# EasyEDA Pro project ProProject_四足舵机控制板V2-PCA9685_2024-05-28.epro, board PCB1
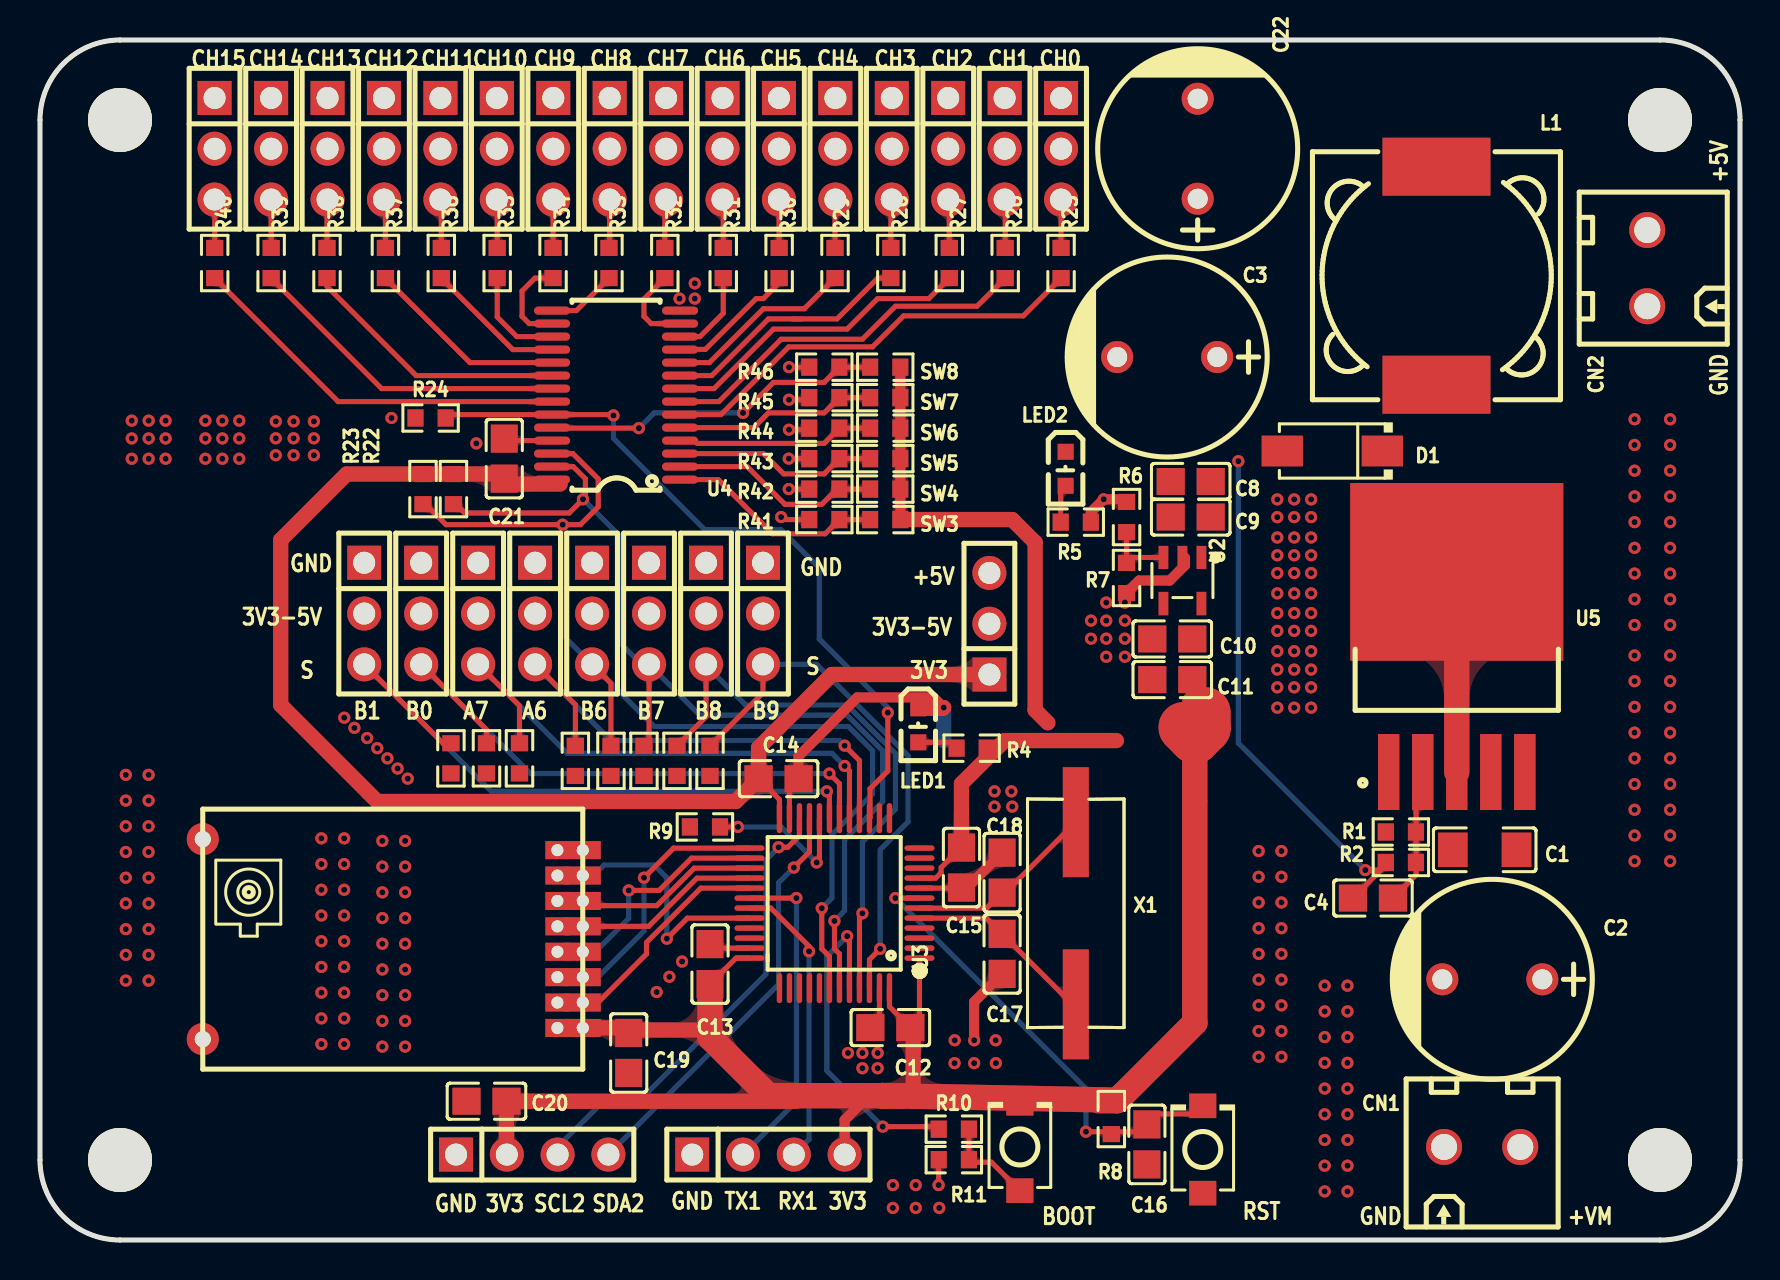
[diagram p5: board, top side]
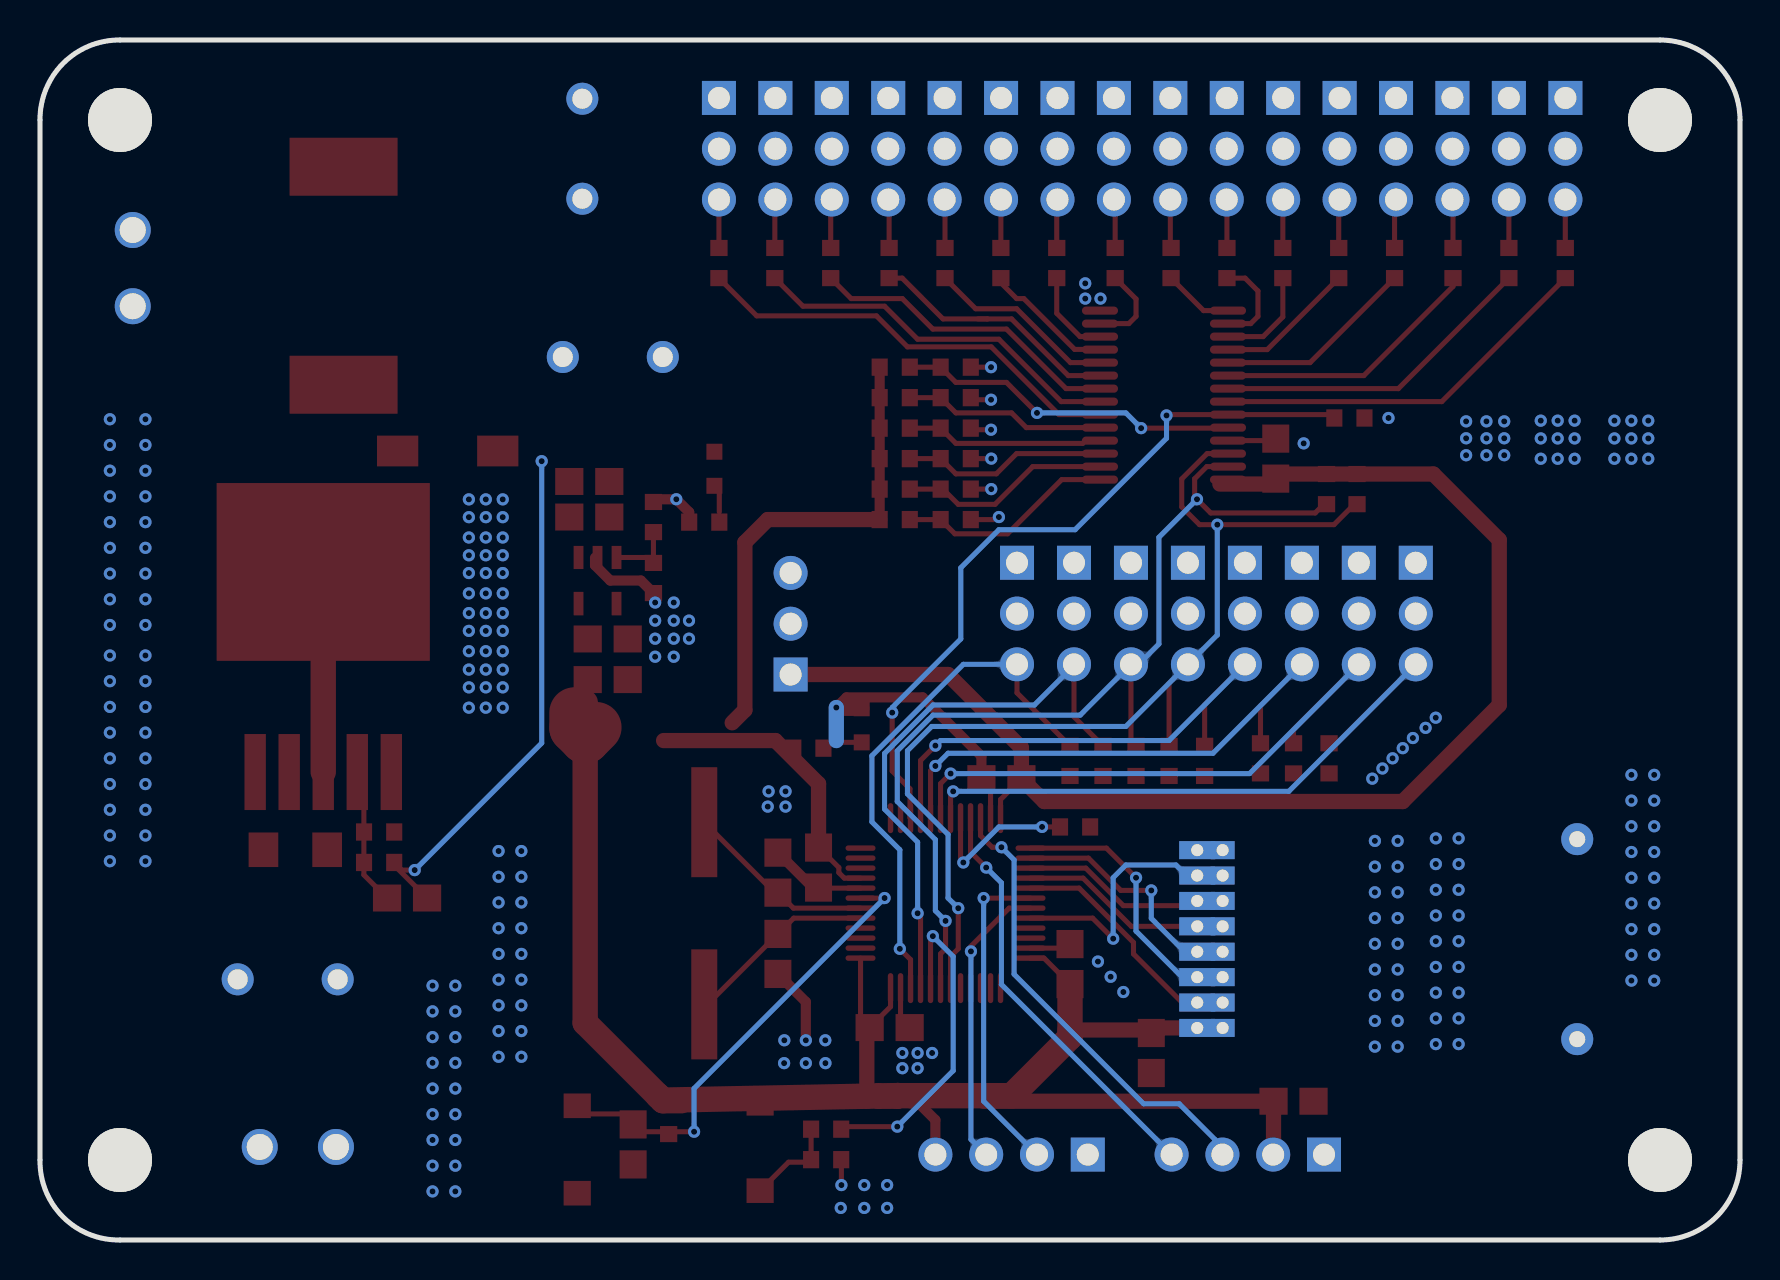
[diagram p6: board, bottom side, seen from below]

Outline 85 x 60 mm; copper layers: Top Layer, Bottom Layer. Coordinates in mm from the lower left corner of the outline.
Outline path: 0,56 0,4 arc(1.17,1.17) 4,0 81,0 arc(83.85,1.15) 85,4 85,56 arc(83.84,58.84) 81,60 4,60 arc(1.17,58.83) 0,56
Stack: Top Layer 0.035mm / Dielectric1 1.51mm FR4 er 4.5 / Bottom Layer 0.035mm

## Design rules (mm)
template: 自定义配置
spacing copperThickness1oz (default): track to track 0.102, other pairs 0.152 to 0.3
spacing copperThickness2oz: track to track 0.203, other pairs 0.152 to 0.3
track width copperThickness1oz (default): min 0.127, default 0.254, max 2.54
track width copperThickness2oz: min 0.203, default 0.254, max 2.54
differential pair differentialPair (default): width min 0.127, default 0.254, max 2.54; gap min 0.152, default 0.152
via viaSize (default): diameter min 0.5, default 0.61, max 10; hole min 0.3, default 0.305, max 6.3

## Placement (name value [footprint] x y rotation side)
C1  1μF  [C1206]  72.24 19.51 0 top
C2  470uF  [CAP-TH_BD10.0-P5.00-D0.6-FD]  72.62 13.03 180 top
C3  470uF  [CAP-TH_BD10.0-P5.00-D0.6-FD]  56.36 44.15 180 top
C4  33nF  [C0805]  66.65 17.1 0 top
C8  100nF  [C0805]  57.54 37.93 0 top
C9  1μF  [C0805]  57.54 36.15 0 top
C10  1μF  [C0805]  56.61 30.05 0 top
C11  100nF  [C0805]  56.61 28.02 0 top
C12  100nF  [C0805]  42.52 10.62 0 top
C13  100nF  [C0805]  33.5 13.8 270 top
C14  100nF  [C0805]  36.93 23.07 180 top
C15  100nF  [C0805]  46.07 18.62 90 top
C16  100nF  [C0805]  55.34 4.78 90 top
C17  22pF  [C0805]  48.1 14.3 270 top
C18  22pF  [C0805]  48.1 18.37 90 top
C19  100nF  [C0805]  29.44 9.35 90 top
C20  100nF  [C0805]  22.32 6.94 0 top
C21  100nF  [C0805]  23.21 39.07 90 top
C22  470uF  [CAP-TH_BD10.0-P5.00-D0.6-FD]  57.88 54.56 90 top
CN1  MX128L-3.81-02P-GN01-Cu-Y-A  [CONN-TH_2P-P3.81_MX128L-3.81-GN01-02P-CU-Y-A]  72.11 4.65 0 top
CN2  MX128L-3.81-02P-GN01-Cu-Y-A  [CONN-TH_2P-P3.81_MX128L-3.81-GN01-02P-CU-Y-A]  80.36 48.59 90 top
D1  SS54  [SMA_L4.4-W2.8-LS5.4-R-RD]  64.62 39.45 180 top
H1  PZ254V-11-03P  [HDR-TH_3P-P2.54-V-M]  24.75 31.32 270 top
H2  PZ254V-11-03P  [HDR-TH_3P-P2.54-V-M]  21.91 31.32 270 top
H3  PZ254V-11-03P  [HDR-TH_3P-P2.54-V-M]  19.06 31.32 270 top
H4  PZ254V-11-03P  [HDR-TH_3P-P2.54-V-M]  16.21 31.32 270 top
H5  PZ254V-11-03P  [HDR-TH_3P-P2.54-V-M]  27.6 31.32 270 top
H6  PZ254V-11-03P  [HDR-TH_3P-P2.54-V-M]  30.45 31.32 270 top
H7  PZ254V-11-03P  [HDR-TH_3P-P2.54-V-M]  33.3 31.32 270 top
H8  PZ254V-11-03P  [HDR-TH_3P-P2.54-V-M]  36.15 31.32 270 top
H11  PZ254V-11-04P  [HDR-TH_4P-P2.54-V-M]  36.42 4.27 0 top
H12  PZ254V-11-04P  [HDR-TH_4P-P2.54-V-M]  24.61 4.27 0 top
H13  PZ254V-11-03P  [HDR-TH_3P-P2.54-V-M]  47.47 30.81 90 top
H14  PZ254V-11-03P  [HDR-TH_3P-P2.54-V-M]  51.05 54.56 270 top
H15  PZ254V-11-03P  [HDR-TH_3P-P2.54-V-M]  48.23 54.56 270 top
H16  PZ254V-11-03P  [HDR-TH_3P-P2.54-V-M]  45.41 54.56 270 top
H17  PZ254V-11-03P  [HDR-TH_3P-P2.54-V-M]  42.59 54.56 270 top
H18  PZ254V-11-03P  [HDR-TH_3P-P2.54-V-M]  39.77 54.56 270 top
H19  PZ254V-11-03P  [HDR-TH_3P-P2.54-V-M]  36.95 54.56 270 top
H20  PZ254V-11-03P  [HDR-TH_3P-P2.54-V-M]  34.13 54.56 270 top
H21  PZ254V-11-03P  [HDR-TH_3P-P2.54-V-M]  31.3 54.56 270 top
H22  PZ254V-11-03P  [HDR-TH_3P-P2.54-V-M]  28.48 54.56 270 top
H23  PZ254V-11-03P  [HDR-TH_3P-P2.54-V-M]  25.66 54.56 270 top
H24  PZ254V-11-03P  [HDR-TH_3P-P2.54-V-M]  22.84 54.56 270 top
H25  PZ254V-11-03P  [HDR-TH_3P-P2.54-V-M]  20.02 54.56 270 top
H26  PZ254V-11-03P  [HDR-TH_3P-P2.54-V-M]  17.2 54.56 270 top
H27  PZ254V-11-03P  [HDR-TH_3P-P2.54-V-M]  14.38 54.56 270 top
H28  PZ254V-11-03P  [HDR-TH_3P-P2.54-V-M]  11.56 54.56 270 top
H29  PZ254V-11-03P  [HDR-TH_3P-P2.54-V-M]  8.73 54.56 270 top
L1  33uH  [IND-SMD_L12.3-W12.3]  69.82 48.21 270 top
LED1  SZYY0603G  [LED0603-R-RD_GREEN]  43.91 25.73 270 top
LED2  SZYY0603G  [LED0603-R-RD_GREEN]  51.28 38.56 270 top
MK1  -  [AS01-SPIPX]  17.24 15.57 180 top
NOREF  -  [Pad_e91]  4 4 0 top
NOREF#2  -  [Pad_e93]  81 4 0 top
NOREF#3  -  [Pad_e86]  4 56 0 top
NOREF#4  -  [Pad_e88]  81 56 0 top
R1  2kΩ  [R0603]  68.04 20.4 180 top
R2  10.5kΩ  [R0603]  68.04 18.88 180 top
R4  2kΩ  [R0603]  46.58 24.59 0 top
R5  2kΩ  [R0603]  51.79 35.89 0 top
R6  10kΩ  [R0603]  54.33 36.15 90 top
R7  100kΩ  [R0603]  54.33 33.1 90 top
R8  10kΩ  [R0603]  53.57 6.05 90 top
R9  10kΩ  [R0603]  33.25 20.65 0 top
R10  2kΩ  [R0603]  45.69 5.54 180 top
R11  10kΩ  [R0603]  45.69 4.02 0 top
R14  1kΩ  [R0603]  26.77 23.96 90 top
R15  1kΩ  [R0603]  23.97 24.08 90 top
R16  1kΩ  [R0603]  22.32 24.08 90 top
R17  1kΩ  [R0603]  20.55 24.08 90 top
R18  1kΩ  [R0603]  28.55 23.96 90 top
R19  1kΩ  [R0603]  30.2 23.96 90 top
R20  1kΩ  [R0603]  31.85 23.96 90 top
R21  1kΩ  [R0603]  33.5 23.96 90 top
R22  10kΩ  [R0603]  20.67 37.55 90 top
R23  10kΩ  [R0603]  19.15 37.55 90 top
R24  10kΩ  [R0603]  19.53 41.1 0 top
R25  10kΩ  [R0603]  51.05 48.85 270 top
R26  10kΩ  [R0603]  48.26 48.85 270 top
R27  10kΩ  [R0603]  45.47 48.85 270 top
R28  10kΩ  [R0603]  42.54 48.85 270 top
R29  10kΩ  [R0603]  39.75 48.85 270 top
R30  10kΩ  [R0603]  36.96 48.85 270 top
R31  10kΩ  [R0603]  34.16 48.85 270 top
R32  10kΩ  [R0603]  31.24 48.85 270 top
R33  10kΩ  [R0603]  28.45 48.85 270 top
R34  10kΩ  [R0603]  25.65 48.85 270 top
R35  10kΩ  [R0603]  22.86 48.85 270 top
R36  10kΩ  [R0603]  20.06 48.85 270 top
R37  10kΩ  [R0603]  17.27 48.85 270 top
R38  10kΩ  [R0603]  14.35 48.85 270 top
R39  10kΩ  [R0603]  11.56 48.85 270 top
R40  10kΩ  [R0603]  8.73 48.85 270 top
R41  10kΩ  [R0603]  39.22 36.02 180 top
R42  10kΩ  [R0603]  39.22 37.55 180 top
R43  10kΩ  [R0603]  39.22 39.07 180 top
R44  10kΩ  [R0603]  39.22 40.59 180 top
R45  10kΩ  [R0603]  39.22 42.12 180 top
R46  10kΩ  [R0603]  39.22 43.64 180 top
SW1  TS-1088-AR02016  [SW-SMD_L3.9-W3.0-P4.45]  58.14 4.53 90 top
SW2  TS-1088-AR02016  [SW-SMD_L3.9-W3.0-P4.45]  48.99 4.65 90 top
SW3  TS342A2P-WZ  [R0603]  42.26 36.02 0 top
SW4  TS342A2P-WZ  [R0603]  42.26 37.55 0 top
SW5  TS342A2P-WZ  [R0603]  42.26 39.07 0 top
SW6  TS342A2P-WZ  [R0603]  42.26 40.59 0 top
SW7  TS342A2P-WZ  [R0603]  42.26 42.12 0 top
SW8  TS342A2P-WZ  [R0603]  42.26 43.64 0 top
U2  RT9013-33GB  [SOT-23-5_L3.0-W1.7-P0.95-LS2.8-BL]  57.12 32.97 180 top
U3  STM32F103C8T6  [LQFP-48_L7.0-W7.0-P0.50-LS9.0-BL]  39.72 16.84 90 top
U4  PCA9685PW,118  [TSSOP-28_L9.7-W4.4-P0.65-LS6.4-TL]  28.8 42.24 180 top
U5  XL4005E1  [TO-263-5_L10.2-W9.2-P1.70-TL]  70.84 28.4 90 top
X1  -  [HC-49S_L11.4-W4.8]  51.79 16.34 270 top

## Footprints (pads in the part's own frame, mm; a bottom-side part is the same pattern mirrored in y, then rotated)
AS01-SPIPX
  round 1.6 hole 0.8: 0(9.105,5.531) 0(9.105,-4.469)
  rect 1.8x0.9 hole 0.6: 1(-9.895,4.971) 2(-9.895,3.701) 3(-9.895,2.431) 4(-9.895,1.161) 5(-9.895,-0.109) 6(-9.895,-1.379) 7(-9.895,-2.649) 8(-9.895,-3.919)
  rect 1.2x0.9 hole 0.6: 1(-8.625,4.971) 2(-8.625,3.701) 3(-8.625,2.431) 4(-8.625,1.161) 5(-8.625,-0.109) 6(-8.625,-1.379) 7(-8.625,-2.649) 8(-8.625,-3.919)
C0805
  rect 1.41x1.35 smd: 1(-1,0) 2(1,0)
C1206
  rect 1.485x1.728 smd: 1(-1.593,0) 2(1.593,0)
CAP-TH_BD10.0-P5.00-D0.6-FD
  round 1.6 hole 1: 1(-2.5,0) 2(2.5,0)
CONN-TH_2P-P3.81_MX128L-3.81-GN01-02P-CU-Y-A
  round 1.8 hole 1.3: 1(-1.905,0) 2(1.905,0)
HC-49S_L11.4-W4.8
  rect 5.5x1.3 smd: 1(-4.553,0) 2(4.553,0)
HDR-TH_3P-P2.54-V-M
  rect 1.7x1.7 hole 1.1: 1(-2.54,0)
  round 1.7 hole 1.1: 2(0,0) 3(2.54,0)
HDR-TH_4P-P2.54-V-M
  rect 1.7x1.7 hole 1.1: 1(-3.81,0)
  round 1.7 hole 1.1: 2(-1.27,0) 3(1.27,0) 4(3.81,0)
IND-SMD_L12.3-W12.3
  rect 2.9x5.4 smd: 1(-5.45,0) 2(5.45,0)
LED0603-R-RD_GREEN
  rect 0.8x0.8 smd: 1(0.851,0) 2(-0.851,0)
LQFP-48_L7.0-W7.0-P0.50-LS9.0-BL
  oval 0.27x1.5 smd: 1(-2.75,-4.25) 2(-2.25,-4.25) 3(-1.75,-4.25) 4(-1.25,-4.25) 5(-0.75,-4.25) 6(-0.25,-4.25) 7(0.25,-4.25) 8(0.75,-4.25) 9(1.25,-4.25) 10(1.75,-4.25) 11(2.25,-4.25) 12(2.75,-4.25) 25(2.75,4.25) 26(2.25,4.25) 27(1.75,4.25) 28(1.25,4.25) 29(0.75,4.25) 30(0.25,4.25) 31(-0.25,4.25) 32(-0.75,4.25) 33(-1.25,4.25) 34(-1.75,4.25) 35(-2.25,4.25) 36(-2.75,4.25)
  oval 1.5x0.27 smd: 13(4.25,-2.75) 14(4.25,-2.25) 15(4.25,-1.75) 16(4.25,-1.25) 17(4.25,-0.75) 18(4.25,-0.25) 19(4.25,0.25) 20(4.25,0.75) 21(4.25,1.25) 22(4.25,1.75) 23(4.25,2.25) 24(4.25,2.75) 37(-4.25,2.75) 38(-4.25,2.25) 39(-4.25,1.75) 40(-4.25,1.25) 41(-4.25,0.75) 42(-4.25,0.25) 43(-4.25,-0.25) 44(-4.25,-0.75) 45(-4.25,-1.25) 46(-4.25,-1.75) 47(-4.25,-2.25) 48(-4.25,-2.75)
Pad_e86
  round 3.2 hole 3.2: 49(0,0)
Pad_e88
  round 3.2 hole 3.2: 50(0,0)
Pad_e91
  round 3.2 hole 3.2: 51(0,0)
Pad_e93
  round 3.2 hole 3.2: 52(0,0)
R0603
  rect 0.806x0.864 smd: 1(-0.753,0) 2(0.753,0)
SMA_L4.4-W2.8-LS5.4-R-RD
  rect 2.062x1.539 smd: 1(2.503,0) 2(-2.503,0)
SOT-23-5_L3.0-W1.7-P0.95-LS2.8-BL
  rect 0.49x1.157 smd: 1(-0.95,-1.153) 2(0,-1.153) 3(0.95,-1.153)
  rect 0.49x1.175 smd: 4(0.95,1.153) 5(-0.95,1.153)
SW-SMD_L3.9-W3.0-P4.45
  rect 1.23x1.36 smd: 1(-2.185,0) 2(2.185,0)
TO-263-5_L10.2-W9.2-P1.70-TL
  rect 3.8x1.069 smd: 1(-5.003,3.404) 2(-5.003,1.702) 3(-5.003,0) 4(-5.003,-1.702) 5(-5.003,-3.404)
  rect 8.89x10.66 smd: 6(5.003,0)
TSSOP-28_L9.7-W4.4-P0.65-LS6.4-TL
  oval 1.804x0.406 smd: 1(-3.2,4.225) 2(-3.2,3.575) 3(-3.2,2.925) 4(-3.2,2.275) 5(-3.2,1.625) 6(-3.2,0.975) 7(-3.2,0.325) 8(-3.2,-0.325) 9(-3.2,-0.975) 10(-3.2,-1.625) 11(-3.2,-2.275) 12(-3.2,-2.925) 13(-3.2,-3.575) 14(-3.2,-4.225) 15(3.2,-4.225) 16(3.2,-3.575) 17(3.2,-2.925) 18(3.2,-2.275) 19(3.2,-1.625) 20(3.2,-0.975) 21(3.2,-0.325) 22(3.2,0.325) 23(3.2,0.975) 24(3.2,1.625) 25(3.2,2.275) 26(3.2,2.925) 27(3.2,3.575) 28(3.2,4.225)

## Nets
As in the schematic.

Pads without a net: MK1 0; NOREF 51; NOREF#2 52; NOREF#3 49; NOREF#4 50; U2 4; U3 2 3 4 10 11 12 13 14 33 34 37 38 39 40 41

## Via types
v1: diameter 0.61, hole 0.305, Top Layer to Bottom Layer, 272 vias

## Routing (per net, layer and track width the routed paths; a pad name or vN(x,y) marks a point on that pad's centre or on a via; arc(x,y) is an arc through that point)
3V3: length 198.7
  Top Layer w0.254: U3.1 43.97,11.08 C12.2 42.47,11.67 U3.48 ; U3.9 44.78,18.09 45.06,18.37 45.06,18.62 46.06,19.62 C15.2 ; U3.36 34.8,14.09 C13.2 ; C14.2 36.97,22.02 U3.24 ; 43.91,7.45 44.14,7.67 ; U4.28 23.42,38.02 23.21,37.81
  Top Layer w0.508: SW8.2 SW7.2 SW6.2 SW5.2 SW4.2 SW3.2 ; H11.4 40.23,6 41.44,7.21
  Top Layer w0.762: 29.03,10.5 28.93,10.6 MK1.1 ; 29.03,10.5 33.5,10.5 ; 29.03,10.5 29.31,10.22 ; H13.1 39.6,28.27 35.93,24.61 C14.2 34.79,21.92 16.86,21.92 12.04,26.75 12.04,35 15.33,38.3 R23.2 R22.2 22.73,38.3 23.23,37.8 26.01,37.8 ; 37.82,6.94 23.59,6.94 23.32,6.67 ; 23.32,6.67 C20.2 ; 23.32,6.67 23.32,4.65 23.47,4.51 23.47,4.27 ; 50.39,25.86 49.76,26.5 49.76,34.88 48.61,36.02 SW3.2 ; C15.2 46.07,22.81 48.23,24.97 53.82,24.97 ; C12.2 43.66,10.48 43.66,7.19
  Top Layer w1.27: 42.11,7.22 43.08,7.2 ; 42.11,7.22 42.11,7.21 ; 42.11,7.22 42.1,7.22 ; 43.08,7.2 43.07,7.19 42.14,7.19 42.11,7.21 ; 43.08,7.2 43.66,7.19 53.87,6.99 54.09,7.21 ; 54.09,7.21 53.85,6.96 52.93,6.96 ; 54.09,7.21 57.74,10.86 57.74,26.88 ; 42.11,7.21 36.42,7.21 33.5,10.13 C13.2
  Top Layer w2.54: 57.19,25.63 57.74,25.08 58.26,25.61 58.26,26.37
+5V: length 29.3
  Top Layer w0.254: v1(66.27,18.5) 66.91,18.5 R2.2 67.29,18.74 C4.1
  Top Layer w0.508: R5.2 52.54,36.39 v1(53.19,37.04) 54.19,37.04 R6.2
  Bottom Layer w0.254: v1(66.27,18.5) 59.92,24.84 v1(59.92,38.94)
GND: length 42.1
  Top Layer w0.254: C13.1 33.7,14.59 U3.35 ; R41.2 37.31,36.02 37.18,36.15 v1(37.06,36.15) ; v1(37.44,39.07) R43.2 ; U3.23 37.47,22.61 C14.1 ; v1(44.93,2.75) 44.93,4.01 R11.1 ; U3.8 46.04,17.59 C15.1 ; R44.2 38.38,40.51 v1(37.45,40.51) ; v1(37.45,43.64) R46.2 ; v1(37.45,42.01) 38.36,42.01 R45.2 ; U4.25 23.37,39.97 23.21,39.81 ; U3.47 41.97,11.08 C12.1 ; v1(37.44,37.55) R42.2
  Top Layer w0.508: R7.1 54.95,32.97 56.49,32.97 57.25,33.73 57.25,34.12 ; C14.1 37.93,24.19 40.87,27.13 44.68,27.13 v1(45.18,26.62) ; C15.1 46.36,17.62 C18.2 ; v1(46.71,9.99) 46.71,11.91 C17.2
  Top Layer w0.762: LED1.2 45.15,26.58 v1(45.18,26.62)
  Bottom Layer w0.762: v1(45.18,26.62) 45.18,24.97
  vias: v1(4.29,23.26) v1(4.29,21.97) v1(4.29,20.69) v1(4.29,19.4) v1(4.29,18.11) v1(4.29,16.83) v1(4.29,15.54) v1(4.29,14.26) v1(4.29,12.97) v1(4.59,40.97) v1(4.59,40.08) v1(4.59,39.06) v1(5.43,40.97) v1(5.43,40.08) v1(5.43,39.06) v1(5.43,23.26) v1(5.43,21.97) v1(5.43,20.69) v1(5.43,19.4) v1(5.43,18.11) v1(5.43,16.83) v1(5.43,15.54) v1(5.43,14.26) v1(5.43,12.97) v1(6.28,40.97) v1(6.28,40.08) v1(6.28,39.06) v1(8.27,40.97) v1(8.27,40.08) v1(8.27,39.06) v1(9.12,40.97) v1(9.12,40.08) v1(9.12,39.06) v1(9.96,40.97) v1(9.96,40.08) v1(9.96,39.06) v1(11.79,40.93) v1(11.79,40.08) v1(11.79,39.24) v1(12.68,40.93) v1(12.68,40.08) v1(12.68,39.24) v1(13.69,40.93) v1(13.69,40.08) v1(13.69,39.24) v1(14.07,20.08) v1(14.07,18.8) v1(14.07,17.51) v1(14.07,16.22) v1(14.07,14.94) v1(14.07,13.65) v1(14.07,12.37) v1(14.07,11.08) v1(14.07,9.8) v1(15.21,26.11) v1(15.21,20.08) v1(15.21,18.8) v1(15.21,17.51) v1(15.21,16.22) v1(15.21,14.94) v1(15.21,13.65) v1(15.21,12.37) v1(15.21,11.08) v1(15.21,9.8) v1(15.72,25.61) v1(16.36,25.1) v1(16.86,24.59) v1(17.12,19.96) v1(17.12,18.67) v1(17.12,17.38) v1(17.12,16.1) v1(17.12,14.81) v1(17.12,13.53) v1(17.12,12.24) v1(17.12,10.95) v1(17.12,9.67) v1(17.37,24.08) v1(17.57,41.1) v1(17.88,23.58) v1(18.26,19.96) v1(18.26,18.67) v1(18.26,17.38) v1(18.26,16.1) v1(18.26,14.81) v1(18.26,13.53) v1(18.26,12.24) v1(18.26,10.95) v1(18.26,9.67) v1(18.39,23.07) v1(21.82,39.83) v1(30.83,12.4) v1(31.47,13.16) v1(31.98,47.07) v1(32.1,13.92) v1(32.74,47.83) v1(32.74,47.07) v1(40.4,9.35) v1(41.12,9.35) v1(41.12,8.59) v1(41.88,9.35) v1(41.88,8.59) v1(42.64,2.75) v1(42.64,1.6) v1(43.79,2.75) v1(43.79,1.6) v1(44.96,1.6) v1(45.74,9.99) v1(45.73,8.84) v1(46.71,8.84) v1(47.72,22.43) v1(47.72,21.67) v1(47.78,9.99) v1(47.79,8.84) v1(48.57,22.43) v1(48.61,21.67) v1(52.55,30.97) v1(52.55,30.07) v1(53.31,31.87) v1(53.31,30.97) v1(53.31,30.07) v1(53.31,29.16) v1(54.24,31.87) v1(54.24,30.97) v1(54.24,30.07) v1(54.24,29.16) v1(60.93,19.45) v1(60.93,18.16) v1(60.93,16.88) v1(60.93,15.59) v1(60.93,14.3) v1(60.93,13.02) v1(60.93,11.73) v1(60.93,10.45) v1(60.93,9.16) v1(61.86,37.03) v1(61.86,36.14) v1(61.86,35.13) v1(61.86,34.24) v1(61.86,33.35) v1(61.86,32.33) v1(61.86,31.34) v1(61.86,30.46) v1(61.86,29.44) v1(61.86,28.52) v1(61.86,27.63) v1(61.86,26.62) v1(62.07,19.45) v1(62.07,18.16) v1(62.07,16.88) v1(62.07,15.59) v1(62.07,14.3) v1(62.07,13.02) v1(62.07,11.73) v1(62.07,10.45) v1(62.07,9.16) v1(62.71,37.03) v1(62.71,36.14) v1(62.71,35.13) v1(62.71,34.24) v1(62.71,33.35) v1(62.71,32.33) v1(62.71,31.34) v1(62.71,30.46) v1(62.71,29.44) v1(62.71,28.52) v1(62.71,27.63) v1(62.71,26.62) v1(63.56,37.03) v1(63.56,36.14) v1(63.56,35.13) v1(63.56,34.24) v1(63.56,33.35) v1(63.56,32.33) v1(63.56,31.34) v1(63.56,30.46) v1(63.56,29.44) v1(63.56,28.52) v1(63.56,27.63) v1(63.56,26.62) v1(64.23,12.72) v1(64.23,11.43) v1(64.23,10.14) v1(64.23,8.86) v1(64.23,7.57) v1(64.23,6.29) v1(64.23,5) v1(64.23,3.72) v1(64.23,2.43) v1(65.37,12.72) v1(65.37,11.43) v1(65.37,10.14) v1(65.37,8.86) v1(65.37,7.57) v1(65.37,6.29) v1(65.37,5) v1(65.37,3.72) v1(65.37,2.43) v1(79.73,41.04) v1(79.73,39.75) v1(79.73,38.47) v1(79.73,37.18) v1(79.73,35.89) v1(79.73,34.61) v1(79.73,33.32) v1(79.73,32.04) v1(79.73,30.75) v1(79.73,29.23) v1(79.73,27.94) v1(79.73,26.66) v1(79.73,25.37) v1(79.73,24.08) v1(79.73,22.8) v1(79.73,21.51) v1(79.73,20.23) v1(79.73,18.94) v1(81.51,41.04) v1(81.51,39.75) v1(81.51,38.47) v1(81.51,37.18) v1(81.51,35.89) v1(81.51,34.61) v1(81.51,33.32) v1(81.51,32.04) v1(81.51,30.75) v1(81.51,29.23) v1(81.51,27.94) v1(81.51,26.66) v1(81.51,25.37) v1(81.51,24.08) v1(81.51,22.8) v1(81.51,21.51) v1(81.51,20.23) v1(81.51,18.94)
A6: length 26
  Top Layer w0.254: H1.3 26.77,26.77 R14.2 ; U3.16 40.97,23.98 v1(40.23,24.72)
  Bottom Layer w0.254: H1.3 24.75,28.76 28.55,24.97 39.98,24.97 v1(40.23,24.72)
A7: length 27.9
  Top Layer w0.254: R15.2 23.97,26.71 H2.3 ; U3.17 40.47,23.46 v1(40.23,23.7)
  Bottom Layer w0.254: v1(40.23,23.7) 39.6,24.34 26.35,24.34 H2.3
B0: length 30.4
  Top Layer w0.254: U3.18 39.97,22.82 v1(39.47,23.32) ; R16.2 22.32,25.52 H3.3
  Bottom Layer w0.254: v1(39.47,23.32) 24.52,23.32 H3.3
B1: length 33.1
  Top Layer w0.254: R17.2 20.16,24.84 H4.3 ; U3.19 39.47,22.3 v1(39.34,22.43)
  Bottom Layer w0.254: v1(39.34,22.43) 22.56,22.43 H4.3
B6: length 54.8
  Top Layer w0.254: 19.15,36.92 20.3,35.77 v1(26.13,35.77) 27.02,35.77 27.91,36.66 27.91,38.05 26.65,39.32 U4.26 ; U3.42 39.47,14.17 39.09,14.56 v1(39.09,16.59) ; H5.3 28.55,27.84 R18.2
  Bottom Layer w0.254: v1(26.13,35.77) 26.13,30.25 H5.3 30.71,25.68 40.41,25.68 41.63,24.46 41.63,22.31 39.6,20.27 39.6,17.1 v1(39.09,16.59)
B7: length 50.5
  Top Layer w0.254: R19.2 30.45,24.96 H6.3 ; U4.27 26.66,38.67 27.27,38.06 27.27,37.16 v1(27.15,37.04) 26.46,36.35 21.24,36.35 20.67,36.92 ; U3.43 39.97,14.31 39.72,14.56 v1(39.72,15.95)
  Bottom Layer w0.254: v1(39.72,15.95) 40.23,16.46 40.23,20.02 42.14,21.92 42.14,24.46 40.35,26.24 32.99,26.24 H6.3 30.07,28.78 29.06,29.8 29.06,35.13 v1(27.15,37.04)
B8: length 28.5
  Top Layer w0.254: v1(41.12,16.34) 40.97,16.19 U3.45 ; H7.3 33.3,26.16 R20.2
  Bottom Layer w0.254: H7.3 33.3,28.73 35.28,26.75 40.35,26.75 42.77,24.33 42.77,21.54 41.12,19.89 v1(41.12,16.34)
B9: length 26.7
  Top Layer w0.254: H8.3 36.15,27.36 R21.2 ; U3.46 41.47,14.02 v1(42.01,14.56)
  Bottom Layer w0.254: v1(42.01,14.56) 42.01,19.51 43.41,20.91 43.41,24.21 38.83,28.78 H8.3
BOOT: length 16.6
  Top Layer w0.254: R10.2 44.81,5.67 v1(42.14,5.67) ; U3.44 40.47,15.08 v1(40.36,15.19)
  Bottom Layer w0.254: v1(40.36,15.19) 39.34,14.18 39.34,8.46 v1(42.14,5.67)
BOOT1: length 7.8
  Top Layer w0.254: R9.2 v1(34.9,20.65) ; U3.20 38.97,19.02 v1(38.83,18.88)
  Bottom Layer w0.254: v1(38.83,18.88) 37.06,20.65 v1(34.9,20.65)
CE: length 11
  Top Layer w0.254: U3.29 33.04,17.59 30.32,14.88 30.32,14.3 27.89,11.87 MK1.2
CSN: length 12.6
  Top Layer w0.254: v1(30.2,18.11) 31.68,19.59 U3.25
  Bottom Layer w0.254: v1(30.2,18.11) 30.2,15.45 27.89,13.14 MK1.3
IRQ: length 12.3
  Top Layer w0.254: U3.32 32.37,16.09 v1(31.34,15.07)
  Bottom Layer w0.254: MK1.7 27.68,18.22 28.2,18.75 30.71,18.75 31.34,18.11 v1(31.34,15.07)
LED0: length 21.9
  Top Layer w0.254: R25.2 49.16,46.21 43.18,46.21 41.63,44.66 37.44,44.66 34.05,41.27 U4.6
LED1: length 18.8
  Top Layer w0.254: R26.2 46.85,46.69 42.77,46.69 41.12,45.04 37.06,45.04 33.94,41.92 U4.7
LED2: length 15.8
  Top Layer w0.254: U4.8 33.7,42.57 36.68,45.55 40.36,45.55 41.88,47.07 44.44,47.07 R27.2
LED3: length 13
  Top Layer w0.254: R28.2 41.89,48.09 39.85,46.05 37.63,46.05 ; U4.9 33.59,43.22 36.42,46.05 37.63,46.05 ; 37.63,46.05 38.1,46.05
LED4: length 9.5
  Top Layer w0.254: U4.10 33.47,43.87 36.17,46.56 38.22,46.56 R29.2
LED5: length 6.6
  Top Layer w0.254: R30.2 36.96,47.86 36.17,47.07 35.81,47.07 33.27,44.53 32.01,44.53 U4.11
LED6: length 5.2
  Top Layer w0.254: 31.24,45.17 33,45.17 34.16,46.33 R31.2
LED7: length 4.3
  Top Layer w0.254: R32.2 30.2,47.05 30.2,46.18 30.56,45.82 U4.13
LED8: length 3.5
  Top Layer w0.254: R33.2 26.82,46.47 U4.15
LED9: length 4.7
  Top Layer w0.254: U4.16 24.46,45.82 24.1,46.18 24.1,47.45 24.75,48.09 R34.2
LED10: length 5.1
  Top Layer w0.254: R35.2 22.86,46.15 23.84,45.17 U4.17
LED11: length 7
  Top Layer w0.254: R36.2 23.64,44.52 U4.18
LED12: length 10.1
  Top Layer w0.254: R37.2 21.5,43.87 U4.19
LED13: length 13.5
  Top Layer w0.254: U4.20 18.81,43.22 14.35,47.68 R38.2
LED14: length 16.3
  Top Layer w0.254: R39.2 17.08,42.57 U4.21
LED15: length 19.4
  Top Layer w0.254: R40.2 14.91,41.92 U4.22
MISO: length 9.2
  Top Layer w0.254: U3.27 32.71,18.59 30.83,16.72 27.38,16.72 MK1.6
MOSI: length 9.3
  Top Layer w0.254: MK1.5 30.43,15.68 32.84,18.09 U3.28
OE: length 36.9
  Top Layer w0.254: v1(28.67,41.23) 28.63,41.27 U4.23 20.45,41.27 R24.2 ; v1(42.39,26.37) 42.39,23.45 41.5,22.56 41.5,21.12 U3.15
  Bottom Layer w0.254: v1(42.39,26.37) 42.39,26.62 38.96,30.05 38.96,33.61 37.06,35.51 33.25,35.51 28.67,40.08 v1(28.67,41.23)
P_A0: length 10.9
  Top Layer w0.254: SW3.1 R41.1 39.26,35.31 36.62,35.31 33.91,38.02 U4.1
P_A1: length 10.6
  Top Layer w0.254: SW4.1 R42.1 39.85,37.55 39.09,36.78 37.25,36.78 35.36,38.67 U4.2
P_A2: length 10.2
  Top Layer w0.254: U4.3 36.17,39.32 37.18,38.31 39.21,38.31 R43.1 SW5.1
P_A3: length 9.9
  Top Layer w0.254: U4.4 32.73,39.97 32.87,39.83 39.21,39.83 R44.1 SW6.1
P_A4: length 10.1
  Top Layer w0.254: SW7.1 R45.1 39.21,41.36 36.42,41.36 35.69,40.62 U4.5
P_A5: length 17.2
  Top Layer w0.254: U4.24 25.63,40.59 v1(29.94,40.59) ; SW8.1 R46.1 39.21,42.88 36.68,42.88 v1(35.15,41.36)
  Bottom Layer w0.254: v1(29.94,40.59) 30.71,41.36 v1(35.15,41.36)
PWM0: length 2.4
  Top Layer w0.254: R25.1 H14.3
PWM1: length 2.4
  Top Layer w0.254: H15.3 48.26,52 R26.1
PWM2: length 2.4
  Top Layer w0.254: H16.3 45.47,51.97 R27.1
PWM3: length 2.4
  Top Layer w0.254: H17.3 42.54,51.98 R28.1
PWM4: length 2.4
  Top Layer w0.254: R29.1 39.75,52 H18.3
PWM5: length 2.4
  Top Layer w0.254: H19.3 36.96,52.01 R30.1
PWM6: length 2.4
  Top Layer w0.254: R31.1 34.16,51.99 H20.3
PWM7: length 2.4
  Top Layer w0.254: H21.3 31.24,51.96 R32.1
PWM8: length 2.4
  Top Layer w0.254: H22.3 28.48,49.64 R33.1
PWM9: length 2.4
  Top Layer w0.254: H23.3 25.65,52.01 R34.1
PWM10: length 2.4
  Top Layer w0.254: H24.3 22.86,52 R35.1
PWM11: length 2.4
  Top Layer w0.254: R36.1 20.06,51.98 H25.3
PWM12: length 2.5
  Top Layer w0.254: H26.3 17.27,51.95 R37.1
PWM13: length 2.4
  Top Layer w0.254: R38.1 14.35,52 H27.3
PWM14: length 2.4
  Top Layer w0.254: R39.1 H28.3
PWM15: length 2.4
  Top Layer w0.254: H29.3 8.73,52.02 R40.1
RST: length 23.1
  Top Layer w0.254: 58.14,6.84 57.6,6.3 55.87,6.3 C16.2 54.98,5.41 v1(52.3,5.41) ; U3.7 42.9,17.09
  Bottom Layer w0.254: v1(52.3,5.41) 52.3,7.57 v1(42.77,17.1)
RX1: length 14.5
  Top Layer w0.254: U3.31 36.54,16.59 38.45,14.69 v1(38.45,14.43)
  Bottom Layer w0.254: v1(38.45,14.43) 38.45,5.03 H11.3
SCK: length 11.1
  Top Layer w0.254: v1(29.44,17.48) 30.96,17.48 32.57,19.09 U3.26
  Bottom Layer w0.254: v1(29.44,17.48) 29.44,16.08 27.77,14.41 MK1.4
SCL2: length 21
  Top Layer w0.254: U3.21 38.47,19.4 v1(37.69,18.62)
  Bottom Layer w0.254: H12.4 36.93,12.78 36.93,17.86 v1(37.69,18.62)
SDA2: length 23.1
  Top Layer w0.254: v1(36.93,19.64) 37.39,19.64 37.97,20.22 U3.22
  Bottom Layer w0.254: v1(36.93,19.64) 36.29,19 36.29,13.29 29.82,6.81 28.04,6.81 26.26,5.03 26.26,4.65 H12.3
TX1: length 16.3
  Top Layer w0.254: v1(37.82,17.1) 37.81,17.09 U3.30
  Bottom Layer w0.254: v1(37.82,17.1) 37.82,6.94 35.15,4.27
$1N1468: length 3.5
  Top Layer w0.254: R6.1 54.33,34.13 54.6,34.13 ; R7.2 54.6,34.13 ; 54.6,34.13 U2.3
$1N2320: length 2
  Top Layer w0.254: R4.1 45.54,24.88 LED1.1
$1N2563: length 4.8
  Top Layer w0.254: R10.1 46.45,3.92 46.41,3.89 47.57,3.89 48.99,2.47
$1N2663: length 1.4
  Top Layer w0.254: 51.03,37.85 51.03,36.4
$1N3311: length 9.6
  Top Layer w0.254: U3.6 47.33,16.59 C18.1 48.27,17.37 X1.1
$1N3317: length 9.6
  Top Layer w0.254: U3.5 47.31,16.09 C17.1 51.63,11.78 X1.2
$1N23767: length 6.9
  Top Layer w0.254: U5.2 68.81,23.07 68.81,18.26 C4.2
$1N27161: length 10
  Top Layer w1.27: U5.3 U5.6

## Copper pours and planes (outline as drawn; the poured copper is in the pictures)
3V3 on Top Layer: 57.63,32.59 58.65,32.59 59.41,31.83 59.41,25.1 59.09,24.78 56.74,26.23 56.74,30.81 57.12,31.19 57.12,32.08
3V3 on Top Layer: 57.12,27.51 56.23,26.62 52.3,26.62 50.39,28.53 50.39,29.1 49.76,29.74 49.57,29.74 49.12,29.29 46.21,29.29 45.19,28.27 45.19,28.01 45.82,27.39 45.82,26.5 46.71,25.61 46.71,24.34 47.34,23.7 50.14,23.7 50.52,24.08 56.87,24.08 57.33,23.62 58.25,23.62 58.25,26.39
+3/5V on Top Layer: 13.94,32.08 13.94,30.56 14.32,30.18 37.5,30.18 37.98,29.69 48.47,29.69 48.87,30.09 48.87,31.58 48.36,32.08 46.2,32.08 45.69,32.59 14.45,32.59
+5V on Top Layer: 57.76,41.61 57.76,33.61 57.9,33.46 59.08,33.46 60.3,34.68 60.3,40.72 61.19,41.61
+5V on Top Layer: 71.98,56.47 74.65,56.47 78.46,52.66 84.1,52.66 84.49,52.27 84.49,48.98 84.36,48.85 74.65,48.85 71.98,51.52
+5V on Top Layer: 73.38,56.47 73.38,50.63 63.73,50.63 61.82,48.72 61.82,42.24 60.81,41.23 57.83,41.23 56.36,42.7 56.36,45.17 54.96,46.56 54.96,54.44 56.23,55.71 65.38,55.71 66.14,56.47
+5V on Top Layer: 58.14,54.18 57.76,54.18 56.23,55.71 7.34,55.71 6.96,55.33 6.96,53.8 7.47,53.29 52.3,53.29 55.53,50.05 58.14,52.66
+5V on Bottom Layer: 46.45,32.08 52.17,32.08 61.57,41.48 61.57,45.67 60.93,46.31 57.38,46.31 56.61,45.55 56.61,41.74 50.9,36.02 47.3,36.02 45.82,34.54 45.82,32.72
GND on Top Layer: 0.86,49.23 2.39,50.75 6.7,50.75 7.85,49.61 7.85,47.45 13.66,41.63 19.19,41.63 19.4,41.43 19.4,40.47 19.66,40.21 20.8,40.21 21.47,40.88 23.84,40.88 24.63,40.08 26.26,40.08 26.26,39.79 24.41,39.79 23.69,39.07 15.08,39.07 11.15,35.13 11.15,25.92 16.42,20.65 0.86,20.65
GND on Top Layer: 47.22,22.69 47.22,18.71 47.43,18.5 48.73,18.5 49.14,18.9 49.14,22.67 48.61,23.19 47.72,23.19
GND on Top Layer: 42.64,3.89 42.64,4.53 43.03,4.91 45.21,4.91 45.56,4.55 45.56,3.64 46.67,2.53 46.67,1.44 45.95,0.72 42.39,0.72 41.63,1.48 41.63,2.87
GND on Top Layer: 36.62,10.94 37.18,11.51 41.88,11.51 42.39,11 42.39,8.43 42.07,8.11 37.16,8.11 36.62,8.65
GND on Top Layer: 14.9,35.83 14.07,35 14.07,33.48 14.7,32.85 37.56,32.85 38.07,33.35 38.07,34.48 37.55,35 20.55,35 19.72,35.83
GND on Top Layer: 32.64,15.61 34.1,15.61 34.34,15.37 34.34,14.26 34.01,13.92 32.74,13.92 32.48,13.67 32.48,11.76 32.1,11.38 30.07,11.38 29.56,11.89 29.56,12.53
GND on Top Layer: 62.58,42.75 60.81,40.97 60.81,33.35 60.04,32.59 60.04,24.21 58.77,22.94 58.77,8.84 60.17,7.45 60.17,3 62.46,0.72 72.11,0.72 72.79,1.4 72.79,2.87 71.47,4.19 71.47,15.36 70.97,15.87 69.27,15.87 68.17,16.97 68.17,25.42 67.48,26.11 65.25,26.11 64.62,26.75 64.62,41.91 63.77,42.75
GND on Top Layer: 69.57,20.6 71.47,20.6 71.47,14.69 69.57,14.69
GND on Top Layer: 17.26,22.57 34.15,22.57 34.39,22.81 34.39,23.58 34.13,23.83 19.78,23.83 16.61,27 14.83,27 14.32,26.5 14.32,25.51
GND on Top Layer: 7.85,59.77 6.96,58.88 6.96,56.34 7.27,56.03 64.93,56.03 65.63,56.72 74.27,56.72 74.78,57.23 74.78,59.01 74.01,59.77
GND on Top Layer: 30.96,47.32 30.83,47.2 30.83,46.44 30.96,46.31 33.37,46.31 33.75,46.69 33.75,47.11 33.37,47.49 33.37,47.96 32.99,48.34 32.11,48.34 31.98,48.21 31.98,47.45 31.85,47.32
GND on Top Layer: 51.79,32.72 52.04,32.97 55.13,32.97 55.51,32.59 55.51,31.28 55.85,30.94 56.11,30.94 56.49,30.56 56.49,27.39 56.11,27 53.31,27 51.79,28.53
GND on Top Layer: 27.14,9.21 27.14,9.2 31.59,9.2 32.09,8.71 32.09,7.82 31.85,7.57 24.74,7.57 24.1,8.21 22.71,8.21 22.07,7.57 22.07,1.73 21.18,0.84 12.93,0.84 0.86,12.91 0.86,21.42 32.74,21.42 33.12,21.03 33.12,20.29 32.82,19.99 30.81,19.99 29.82,19 24.99,19 24.23,18.24 24.23,10.49 25.12,9.61 26.77,9.61 27.17,9.21
GND on Top Layer: 78.33,48.47 77.19,47.32 77.19,8.72 78.08,7.83 82.52,7.83 84.17,9.48 84.17,47.45 83.16,48.47
GND on Top Layer: 56.55,35.26 56.87,34.82 56.87,33.61 57.12,33.35 57.38,33.35 57.5,33.48 57.5,41.23 55.98,42.75 55.98,45.17 53.95,47.2 51.28,47.2 49.76,45.67 45.04,45.67 44.04,44.68 44.04,38.41 54.23,38.41 55.22,37.42 55.22,35.77 55.72,35.26
GND on Top Layer: 59.66,8.46 59.66,5.81 58.37,4.53 52.02,4.53 50.77,3.28 50.77,0.72 63.47,0.72 63.73,0.97 63.73,4.4
GND on Bottom Layer: 36.17,37.55 36.17,36.28 36.55,35.89 37.82,35.89
GND on Bottom Layer: 39.47,34.75 39.47,30.43 43.15,26.75 43.15,25.68 43.91,24.91 43.91,24.63 44.21,24.34 46.45,24.34 46.45,26.37 45.95,26.88 45.95,32.08 45.44,32.59 45.44,35.51 40.23,35.51
GND on Bottom Layer: 19.15,0.72 19.15,8.08 22.58,8.08 22.58,5.78 22.09,5.3 22.09,3.23 22.45,2.87 29.31,2.87 29.82,3.38 29.82,4.91 32.37,7.46 33.5,7.46 34.01,6.96 34.01,3 34.13,2.87 41.63,2.87 42.64,3.89 42.64,6.01 39.81,8.89 39.81,12.73 41.69,14.05 44.8,14.05 51.53,7.32 51.53,5.03 52.04,4.53 52.63,4.53 53.14,5.03 53.14,14.81 71.9,14.81 71.9,1.5 71.11,0.72
GND on Bottom Layer: 31.98,18.6 31.98,14.94 29.44,12.4 29.44,9.93 29.99,9.38 31.56,9.38 35.88,13.71 35.88,17.89 34.9,18.88 32.25,18.88
GND on Bottom Layer: 0.86,37.42 0.86,21.8 20.71,21.8 14.7,27.81 14.7,32.21 15.21,32.72 24.86,32.72 25.37,33.23 25.37,37.42
GND on Bottom Layer: 43.91,17.1 53.31,7.7 53.31,7.06 70.87,7.06 71.73,7.92 71.73,14.43 74.52,17.22 82.9,17.22 84.17,18.5 84.17,28.91 51.36,28.91 49.08,26.62 45.82,26.62 43.91,24.72
GND on Bottom Layer: 6.96,58.88 6.96,56.31 7.46,55.81 59.43,55.81 59.53,55.71 60.42,55.71 62.58,53.55 64.11,55.07 64.11,59.77 7.85,59.77
GND on Bottom Layer: 50.01,29.42 50.01,27 59.66,27 59.66,38.05 59.41,38.31 58.9,38.31
GND on Bottom Layer: 2.26,50.5 0.86,49.1 0.86,37.42 2.51,35.77 24.61,35.77 26.01,37.16 26.01,40.28 27.7,41.97 35.69,41.97 36.18,41.48 36.18,37.03 39.98,33.23 44.04,33.23 47.6,36.78 50.91,36.78 55.98,41.85 55.98,48.72 54.2,50.5
GND on Bottom Layer: 30.58,22.05 33.81,22.05 34.19,21.67 34.19,20.4 35.89,18.7 35.89,17.81 32.31,17.81 29.82,20.3 29.82,21.29
GND on Bottom Layer: 62.46,41.99 60.42,39.96 60.42,27.64 84.17,27.64 84.17,47.45 83.16,48.47 62.46,48.47
GND on Bottom Layer: 60.93,59.77 73.96,59.77 75.03,58.7 75.03,56.09 77.19,53.93 77.19,50.23 78.96,48.47 83.19,48.47 84.11,47.55 62.48,47.55 62.46,47.58 62.46,53.67 59.79,56.34 59.79,58.63
GND on Bottom Layer: 24.23,5.79 22.44,5.79 22.07,5.43 22.07,1.73 21.05,0.72 13.05,0.72 0.86,12.91 0.86,22.05 30.83,22.05 30.83,19.36 28.39,19.36 28.04,19 24.99,19 24.23,18.24
VM on Top Layer: 73.12,2.87 75.89,2.87 76.42,3.4 76.42,26.12 75.66,26.88 72.52,26.88 71.85,26.21 71.85,4.14
$1N27161 on Top Layer: 65.5,42.62 65.5,28.91 76.17,28.91 76.17,40.69 72.65,44.22 67.09,44.22

Small or netless copper shapes (teardrops, artwork), in the pictures only: 284 on Top Layer, 46 on Bottom Layer

## Text on the board
Top Silkscreen Layer: 3V3-5V | GND | S | B1 | B0 | A7 | A6 | SCL2 | B6 | SDA2 | B7 | B8 | TX1 | B9 | RX1 | 3V3 | +5V | BOOT | RST | CH15 | CH14 | CH13 | CH12 | CH11 | CH10 | CH9 | CH8 | CH7 | CH6 | CH5 | CH4 | CH3 | CH2 | CH1 | CH0 | +VM
